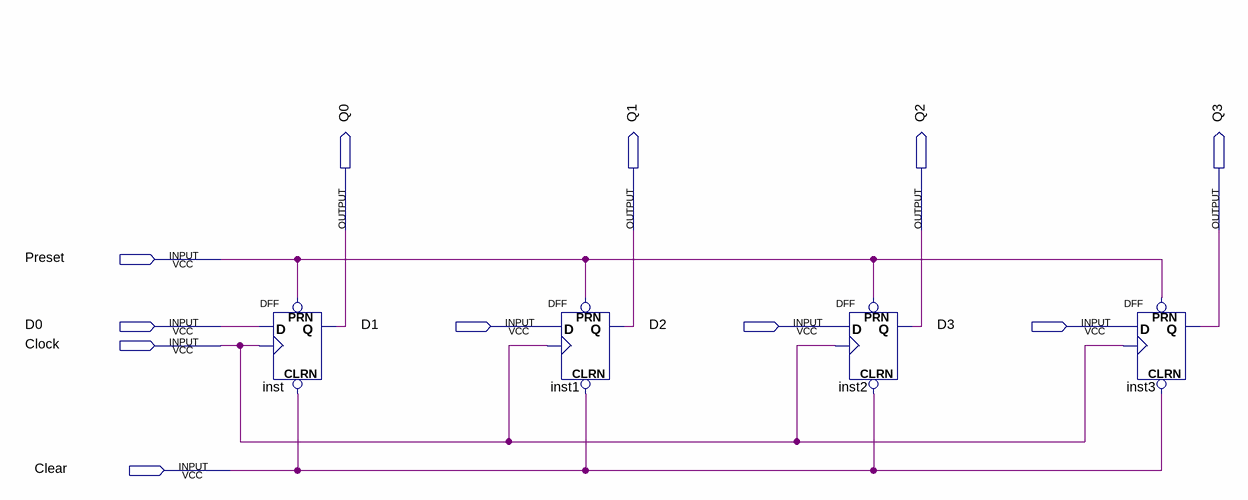
[diagram p0: schematic sheet]
// Quartus schematic Registrador4BitsPIPO.bdf as structural Verilog: 4 symbols, 11 pins
module Registrador4BitsPIPO (
  input  Preset,
  input  D0,
  input  D1,
  input  D2,
  input  D3,
  input  Clock,
  input  Clear,
  output Q0,
  output Q1,
  output Q2,
  output Q3
);

  DFF inst (.CLRN(Clear), .CLK(Clock), .D(D0), .PRN(Preset), .Q(Q0));
  DFF inst1 (.CLRN(Clear), .CLK(Clock), .D(D1), .PRN(Preset), .Q(Q1));
  DFF inst2 (.CLRN(Clear), .CLK(Clock), .D(D2), .PRN(Preset), .Q(Q2));
  DFF inst3 (.CLRN(Clear), .CLK(Clock), .D(D3), .PRN(Preset), .Q(Q3));
endmodule
